# EAGLE design AK-Logger (EAGLE 7.5.0)
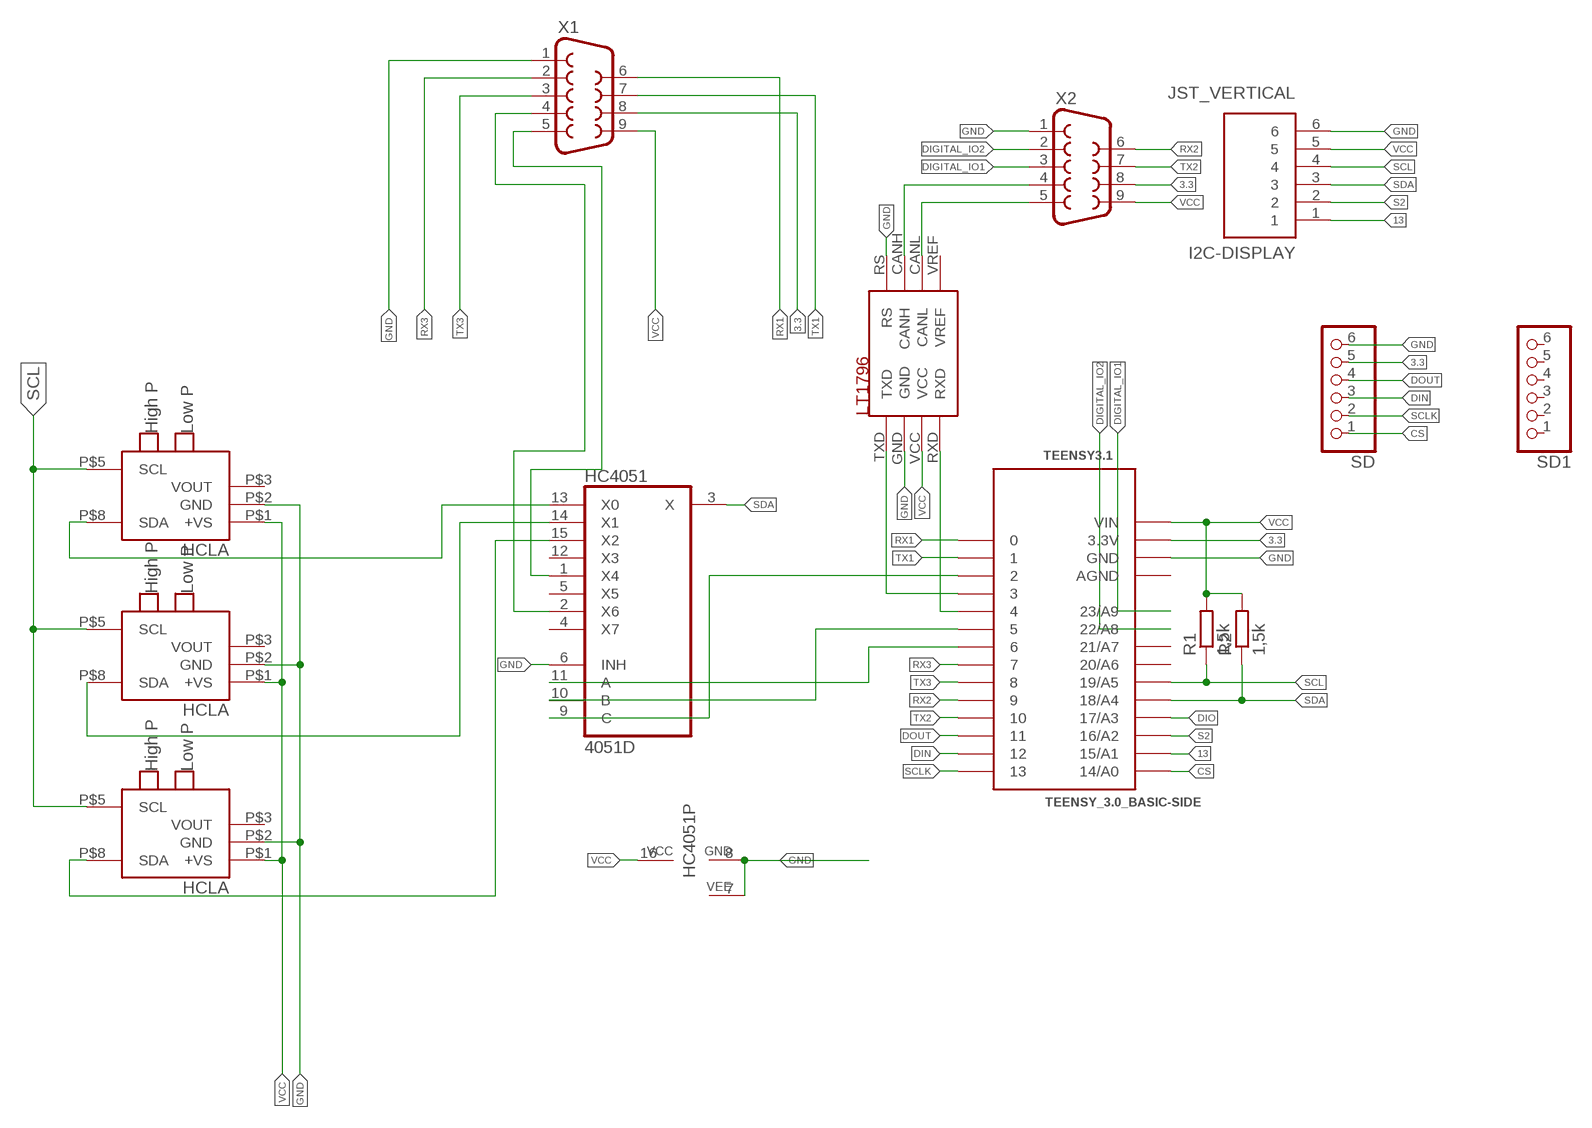
[diagram p0: schematic, sheet 1]

## Parts
HC4051  4051D  [SO16]
HCLA0  HCLA  [HCLA]
HCLA1  HCLA  [HCLA]
HCLA2  HCLA  [HCLA]
I2C-DISPLAY  JST_VERTICAL  [JST-6-SMD-VERT-1.0MM]
R1  1,5k  R-EU_R1206  [R1206]
R2  1,5k  R-EU_R1206  [R1206]
SD  PINHD-1X6  [1X06]
SD1  PINHD-1X6  [1X06]
TEENSY3.1  TEENSY_3.0_BASIC-SIDE  [TEENSY_3.0_BASIC-SIDE]
U$6  LT1796  [SO08]
X1  F09H  [F09H]
X2  F09H  [F09H]

## Nets
3.3: SD.5 TEENSY3.1.3.3V X1.8 X2.8
13: I2C-DISPLAY.1 TEENSY3.1.15/A1
CS: SD.1 TEENSY3.1.14/A0
DIGITAL_IO1: TEENSY3.1.23/A9 X2.3
DIGITAL_IO2: TEENSY3.1.22/A8 X2.2
DIN: SD.3 TEENSY3.1.12
DIO: TEENSY3.1.17/A3
DOUT: SD.4 TEENSY3.1.11
GND: HC4051.6(INH) HC4051.7(VEE) HC4051.8(GND) HCLA0.P$2(GND) HCLA1.P$2(GND) HCLA2.P$2(GND) I2C-DISPLAY.6 SD.6 TEENSY3.1.GND U$6.GND U$6.RS X1.1 X2.1
N$1: HC4051.14(X1) HCLA1.P$8(SDA)
N$2: HC4051.13(X0) HCLA0.P$8(SDA)
N$3: HC4051.15(X2) HCLA2.P$8(SDA)
N$4: HC4051.10(B) TEENSY3.1.5
N$5: TEENSY3.1.3 U$6.TXD
N$6: U$6.CANL X2.5
N$7: TEENSY3.1.4 U$6.RXD
N$8: U$6.CANH X2.4
N$9: HC4051.11(A) TEENSY3.1.6
N$10: HC4051.9(C) TEENSY3.1.2
N$12: HC4051.1(X4) X1.5
N$13: HC4051.2(X6) X1.4
RX1: TEENSY3.1.0 X1.6
RX2: TEENSY3.1.9 X2.6
RX3: TEENSY3.1.7 X1.2
S2: I2C-DISPLAY.2 TEENSY3.1.16/A2
SCL: HCLA0.P$5(SCL) HCLA1.P$5(SCL) HCLA2.P$5(SCL) I2C-DISPLAY.4 R1.1 TEENSY3.1.19/A5
SCLK: SD.2 TEENSY3.1.13
SDA: HC4051.3(X) I2C-DISPLAY.3 R2.1 TEENSY3.1.18/A4
TX1: TEENSY3.1.1 X1.7
TX2: TEENSY3.1.10 X2.7
TX3: TEENSY3.1.8 X1.3
VCC: HC4051.16(VCC) HCLA0.P$1(+VS) HCLA1.P$1(+VS) HCLA2.P$1(+VS) I2C-DISPLAY.5 R1.2 R2.2 TEENSY3.1.VIN U$6.VCC X1.9 X2.9
Unconnected: HC4051.4(X7) HC4051.5(X5) HC4051.12(X3) HCLA0.P$3(VOUT) HCLA1.P$3(VOUT) HCLA2.P$3(VOUT) SD1.1 SD1.2 SD1.3 SD1.4 SD1.5 SD1.6 TEENSY3.1.20/A6 TEENSY3.1.21/A7 U$6.VREF

## Power pins joined to a net without a drawn wire
AGND: TEENSY3.1.AGND

## Library data of the parts
HC4051 = 40xx:4051: 8-channel ANALOG MULTIPLEXER
HCLA0 HCLA1 HCLA2 = HCLA:HCLA
I2C-DISPLAY = SparkFun-Connectors:JST_VERTICAL; PROD_ID: CONN-08249
R1 R2 = rcl:R-EU_: RESISTOR, European symbol
SD SD1 = pinhead:PINHD-1X6: PIN HEADER
TEENSY3.1 = Teensy3.0:TEENSY_3.0_BASIC-SIDE
U$6 = LT1796:LT1796
X1 X2 = con-subd:F09: SUB-D; OC_FARNELL: unknown; OC_NEWARK: unknown

## Board
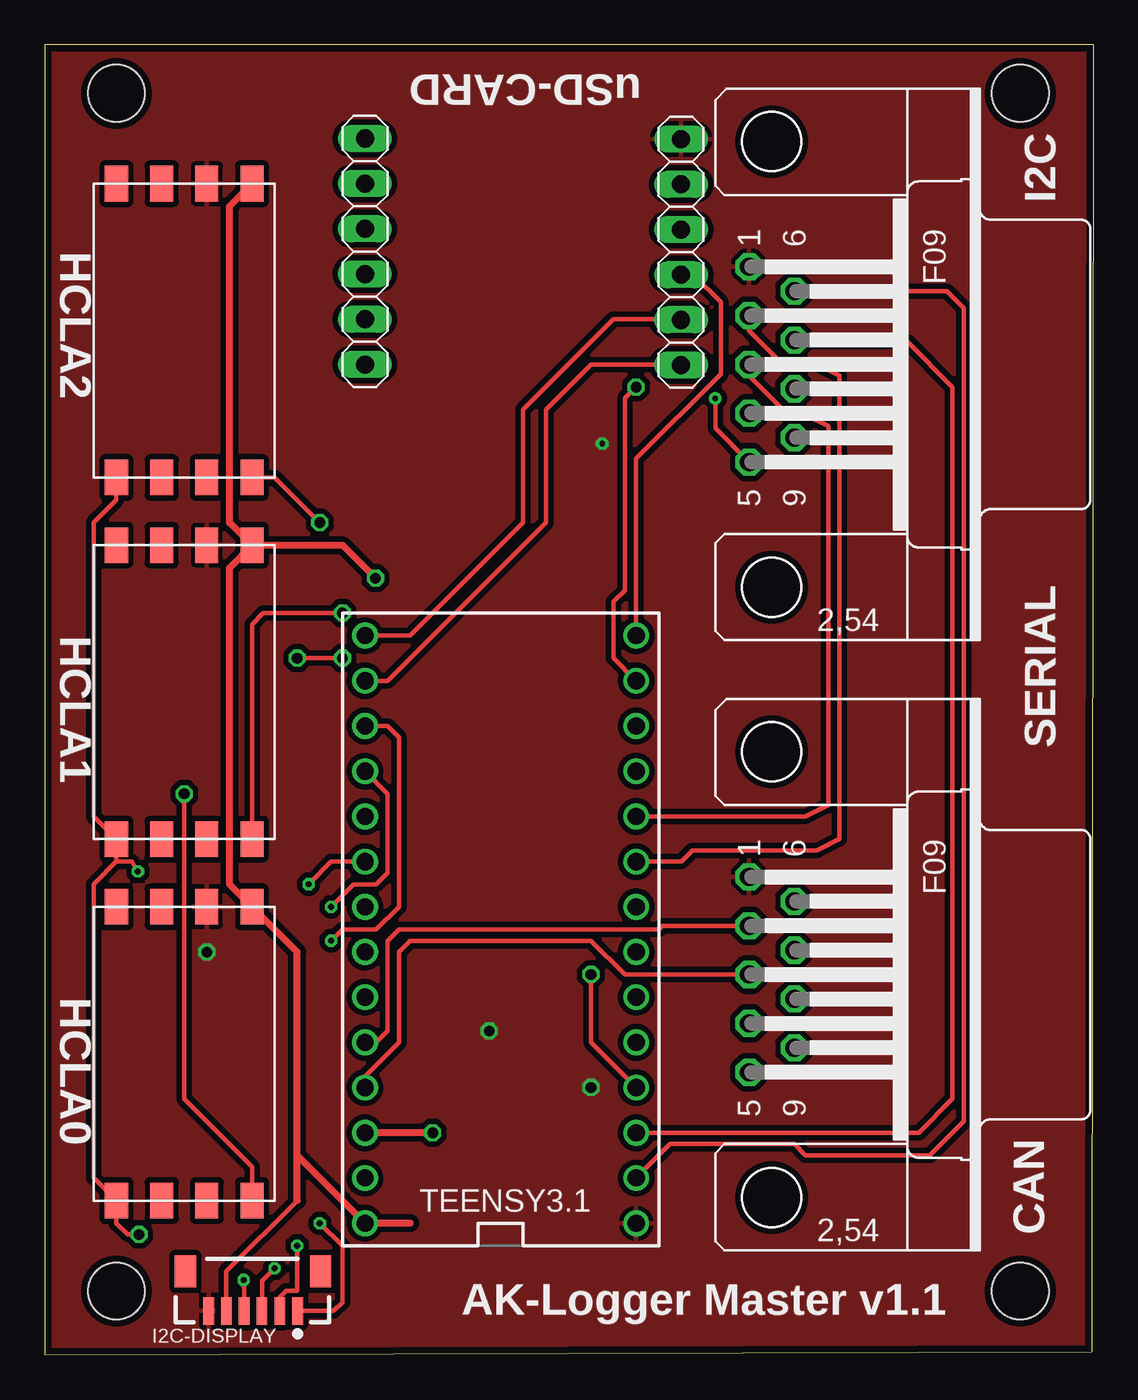
[diagram p1: board, top side]
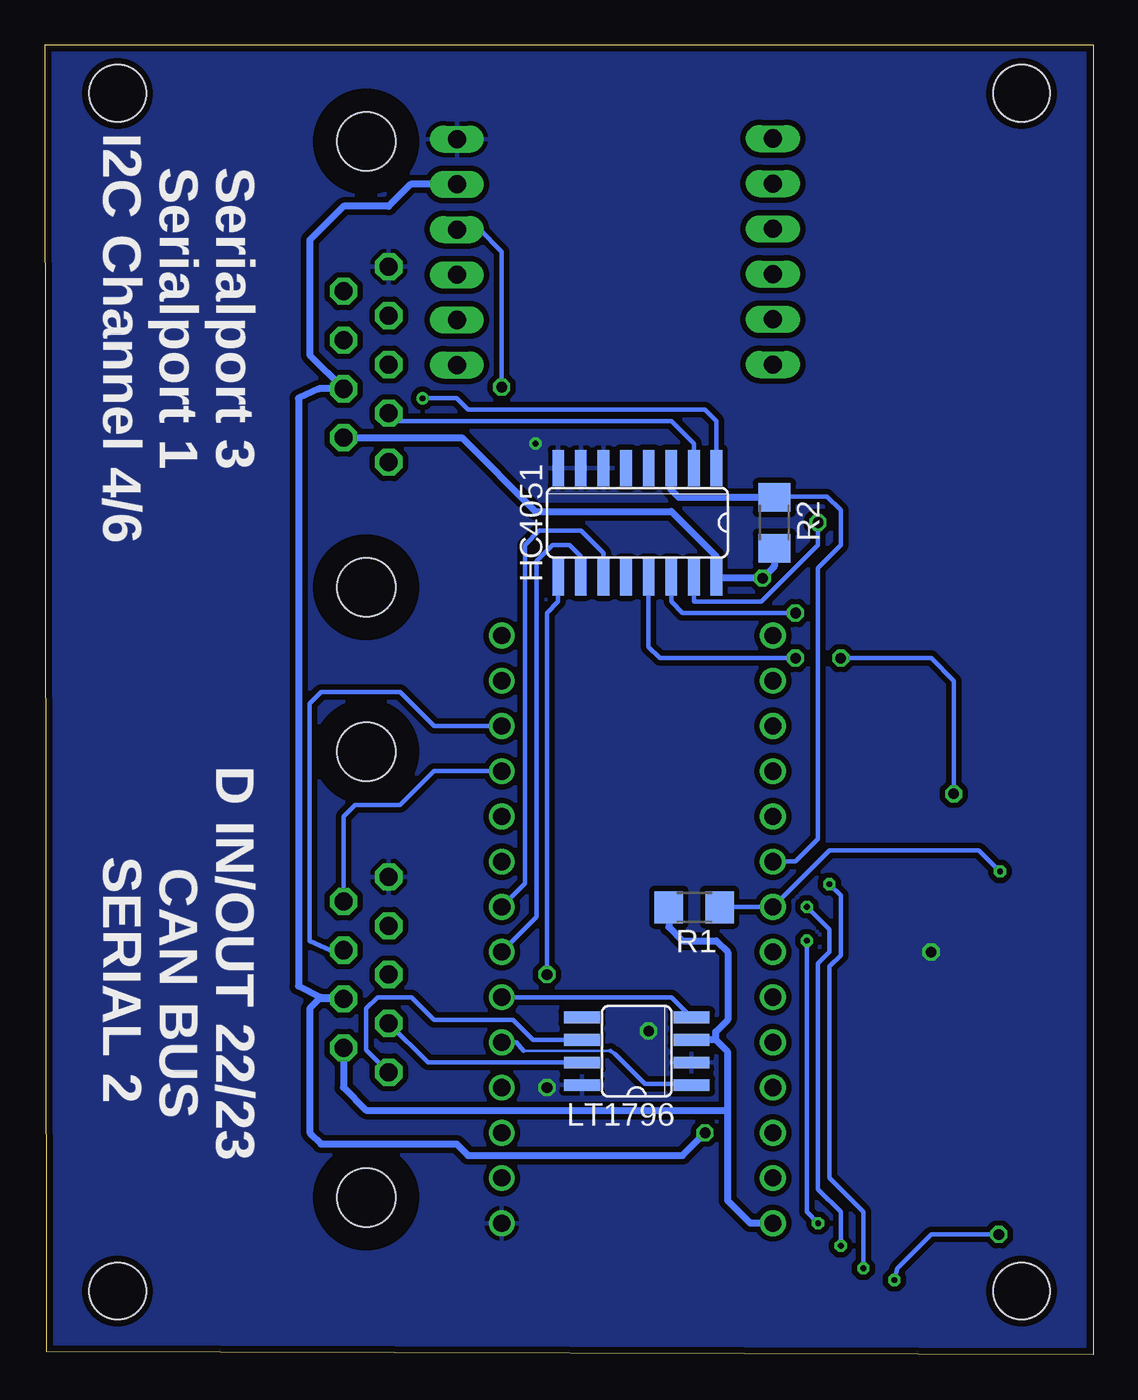
[diagram p2: board, bottom side, seen from below]

Size 58.95 x 73.65 mm. Coordinates in mm from the lower left corner, seen from the top.
Outline: 0,73.65 0,0 58.85,0.17 58.95,73.63 0,73.65
Copper layers (1*16): Top 0.0356mm / dielectric 1.5011mm / Bottom 0.0356mm
Design rules "LaenPCBOrder": minimum track width 6mil, minimum drill 13mil, track to track 6mil, track to pad 6mil, pad to pad 6mil, via to via 6mil, smd to smd 6mil, copper to edge 15mil, drill to drill 6mil, minimum pad ring 7mil, minimum via ring 7mil, stop-mask expansion 3mil, vias tented up to drill 0mil, thermal gap 10mil
Holes 3.2 mm at 4.04,70.91 54.84,70.91 4.04,3.6 54.84,3.6

### Footprints (pad centres in the part's own frame; a part is rotated, then mirrored left to right if it is on the bottom)
SO16 = smd 0.66 x 2.032: 1 -4.445,-3.073; 2 -3.175,-3.073; 3 -1.905,-3.073; 4 -0.635,-3.073; 5 0.635,-3.073; 6 1.905,-3.073; 7 3.175,-3.073; 8 4.445,-3.073; 9 4.445,3.073; 10 3.175,3.073; 11 1.905,3.073; 12 0.635,3.073; 13 -0.635,3.073; 14 -1.905,3.073; 15 -3.175,3.073; 16 -4.445,3.073
HCLA = smd 1.3 x 2: P$1 -3.81,-7.62; P$2 -1.27,-7.62; P$3 1.27,-7.62; P$4 3.81,-7.62; P$5 3.81,8.89; P$6 1.27,8.89; P$7 -1.27,8.89; P$8 -3.81,8.89
JST-6-SMD-VERT-1.0MM = smd 0.6 x 1.55: 1 -2.54,1.27; 2 -1.54,1.27; 3 -0.54,1.27; 4 0.46,1.27; 5 1.46,1.27; 6 2.46,1.27 | smd 1.2 x 1.8: P$1 -3.84,-0.955; P$2 3.76,-0.955
R1206 = smd 1.6 x 1.803: 1 -1.422,0; 2 1.422,0
1X06 = drill 1.016 long: 1 -6.35,0; 2 -3.81,0; 3 -1.27,0; 4 1.27,0; 5 3.81,0; 6 6.35,0
TEENSY_3.0_BASIC-SIDE = drill 0.965: 0 -7.62,13.97; 1 -7.62,11.43; 2 -7.62,8.89; 3 -7.62,6.35; 3.3V 7.62,11.43; 4 -7.62,3.81; 5 -7.62,1.27; 6 -7.62,-1.27; 7 -7.62,-3.81; 8 -7.62,-6.35; 9 -7.62,-8.89; 10 -7.62,-11.43; 11 -7.62,-13.97; 12 -7.62,-16.51; 13 7.62,-16.51; 14/A0 7.62,-13.97; 15/A1 7.62,-11.43; 16/A2 7.62,-8.89; 17/A3 7.62,-6.35; 18/A4 7.62,-3.81; 19/A5 7.62,-1.27; 20/A6 7.62,1.27; 21/A7 7.62,3.81; 22/A8 7.62,6.35; 23/A9 7.62,8.89; AGND 7.62,13.97; GND -7.62,16.51; VIN 7.62,16.51
SO08 = smd 0.66 x 2.032: CANH -0.635,3.073; CANL 0.635,3.073; GND -0.635,-3.073; RS -1.905,3.073; RXD 1.905,-3.073; TXD -1.905,-3.073; VCC 0.635,-3.073; VREF 1.905,3.073
F09H = drill 1.016 octagon: 1 -5.486,-1.27; 2 -2.743,-1.27; 3 0,-1.27; 4 2.743,-1.27; 5 5.486,-1.27; 6 -4.115,1.27; 7 -1.372,1.27; 8 1.372,1.27; 9 4.115,1.27 | hole 3.302: -12.522,0; 12.522,0

### Placement (x,y rotation side)
HC4051  25.63,46.78 180 bottom
HCLA0  7.85,17.57 180 top
HCLA1  7.85,37.89 180 top
HCLA2  7.85,58.21 180 top
I2C-DISPLAY  11.68,3.75 180 top
R1  22.44,25.16 180 bottom
R2  17.93,46.77 270 bottom
SD  35.78,61.98 90 top
SD1  18.01,62.02 90 top
TEENSY3.1  25.63,23.92 180 top
U$6  25.67,17.07 90 bottom
X1  40.87,55.67 270 top
X2  40.87,21.38 270 top

### Tracks (layer width: path | path; a pad name or v marks a point on that pad's centre or on a via)
3.3  (via drill 0.6)
  Top 0.406: v21.82,12.49 TEENSY3.1.3.3V
  Bottom 0.406: v21.82,12.49 23.09,11.22 35.16,11.22 35.79,11.85 43.41,11.85 44.05,12.49 44.05,19.47 43.52,20.01 X2.8 42.25,20.11 43.41,20.11 44.68,20.74 44.68,53.76 43.52,54.3 X1.8 44.05,56.2 44.05,62.65 42.14,64.56 39.6,64.56 38.37,65.79 SD.5
13  (via drill 0.33)
  Top 0.254: v16.11,23.28 16.74,23.92 18.65,23.92 19.92,25.19 19.92,34.71 19.28,35.35 TEENSY3.1.15/A1 | I2C-DISPLAY.1 16.26,2.48 16.74,2.96 16.74,6.14 v15.47,7.41
  Bottom 0.254: v15.47,7.41 16.11,8.04 v16.11,23.28
CS
  Top 0.254: TEENSY3.1.14/A0 19.28,37.89 28.17,46.78 28.17,53.13 30.71,55.67 35.74,55.67 SD.1
DIGITAL_IO1
  Top 0.254: TEENSY3.1.23/A9 18.01,15.66 19.92,17.57 19.92,22.65 20.55,23.28 30.71,23.28 32.62,21.38 X2.3
DIGITAL_IO2
  Top 0.254: X2.2 34.73,24.12 34.52,23.92 19.92,23.92 19.28,23.28 19.28,18.2 18.65,17.57 TEENSY3.1.22/A8
DIN
  Top 0.254: TEENSY3.1.12 33.25,50.38 38.01,55.14 38.01,59.16 36.43,60.75 35.81,60.75 SD.3
DOUT  (via drill 0.6)
  Top 0.254: TEENSY3.1.11 31.98,39.16 31.98,42.33 32.62,42.97 32.62,53.76 v33.25,54.4
  Bottom 0.254: v33.25,54.4 33.25,62.02 34.52,63.29 35.74,63.29 SD.4
GND  (via drill 0.33, 0.6)
  other vias: 25,18.2 30.71,15.03 31.35,51.22 9.12,22.65
  pour Bottom (isolate 0.305): 58.65,0.42 0.23,0.42 0.23,73.45 58.65,73.45
  pour Top (isolate 0.305): 0.23,0.42 58.65,0.42 58.65,73.45 0.23,73.45
N$1  (via drill 0.6)
  Top 0.254: HCLA1.P$8 11.66,41.06 12.3,41.7 v16.74,41.7
  Bottom 0.254: HC4051.14 23.73,42.33 23.09,41.7 v16.74,41.7
N$2  (via drill 0.6)
  Top 0.254: v16.74,39.16 v14.2,39.16 | v7.85,31.54 7.85,14.39 11.66,10.58 HCLA0.P$8
  Bottom 0.254: HC4051.13 25,39.79 24.36,39.16 v16.74,39.16 | v14.2,39.16 9.12,39.16 7.85,37.89 v7.85,31.54
N$3  (via drill 0.6)
  Top 0.254: v15.47,46.78 12.93,49.32 HCLA2.P$8
  Bottom 0.254: HC4051.15 22.46,42.33 18.65,42.33 15.47,45.51 v15.47,46.78
N$4
  Bottom 0.254: HC4051.10 28.81,44.87 29.44,45.51 30.4,45.51 31.29,44.62 31.29,24.62 TEENSY3.1.5
N$5
  Bottom 0.152: 32.03,17.09 27.16,17.09
  Bottom 0.254: TEENSY3.1.3 32.41,17.57 32.03,17.09 | 27.16,17.09 26.9,16.93 26.89,16.93 25.19,15.23 22.66,15.23 U$6.TXD
N$6
  Bottom 0.254: U$6.CANL 31.49,17.71 32.62,18.84 37.06,18.84 38.33,20.11 40.24,20.11 40.87,19.47 40.87,17.16 X2.5
N$7
  Bottom 0.254: TEENSY3.1.4 23.73,20.11 U$6.RXD
N$8
  Bottom 0.254: U$6.CANH 37.41,16.44 X2.4
N$9
  Bottom 0.254: HC4051.11 27.54,45.07 28.79,46.32 31.15,46.32 31.94,45.53 31.94,26.5 TEENSY3.1.6
N$10  (via drill 0.6)
  Top 0.254: v30.71,21.38 30.71,17.57 TEENSY3.1.2
  Bottom 0.254: HC4051.9 30.08,42.33 30.71,41.7 v30.71,21.38
N$12  (via drill 0.33 pad 0.25)
  Top 0.254: v37.7,53.76 37.7,52.09 X1.5
  Bottom 0.254: HC4051.1 21.19,52.49 21.82,53.13 35.16,53.13 35.79,53.76 v37.7,53.76
N$13
  Bottom 0.254: HC4051.2 22.46,51.22 23.73,52.49 39.17,52.49 X1.4
RX1
  Top 0.254: X1.6 50.73,59.78 51.67,58.84 51.67,13.12 49.76,11.22 42.78,11.22 42.14,11.85 35.16,11.85 TEENSY3.1.0
RX2
  Bottom 0.254: X2.6 42.14,30.27 41.51,30.9 38.97,30.9 37.06,32.81 TEENSY3.1.9
RX3
  Top 0.254: X1.2 39.6,57.57 41.51,55.67 43.41,55.67 44.68,55.03 44.68,29 43.41,28.36 36.43,28.36 35.79,27.73 TEENSY3.1.7
S2  (via drill 0.33)
  Top 0.254: v16.11,25.19 17.38,26.46 18.65,26.46 19.28,27.09 19.28,31.54 TEENSY3.1.16/A2 | I2C-DISPLAY.2 13.22,3.25 13.57,3.6 14.2,3.6 v14.2,6.14
  Bottom 0.254: v16.11,25.19 14.84,23.92 14.84,22.65 15.47,22.01 15.47,9.31 14.2,8.04 v14.2,6.14
SCL  (via drill 0.33, 0.6)
  Top 0.254: HCLA2.P$5 4.04,48.05 2.77,46.78 2.77,30.27 HCLA1.P$5 4.04,27.73 | 4.04,27.73 2.77,26.46 2.77,9.95 HCLA0.P$5 4.04,7.41 4.68,6.77 v5.31,6.77 | 4.04,27.73 4.91,27.73 v5.25,27.18 | I2C-DISPLAY.4 11.22,4.04 v11.19,4.21
  Bottom 0.254: 20.72,25.19 R1.1 20.99,25.19 TEENSY3.1.19/A5 14.84,28.36 6.44,28.36 v5.25,27.18 | v11.19,4.21 11.03,4.87 9.12,6.77 v5.31,6.77
SCLK
  Top 0.254: TEENSY3.1.13 20.55,40.43 26.9,46.78 26.9,53.13 31.98,58.21 35.74,58.21 SD.2
SDA  (via drill 0.33)
  Top 0.254: I2C-DISPLAY.3 12.22,4.16 v12.93,4.87 | v14.84,26.46 16.11,27.73 TEENSY3.1.18/A4
  Bottom 0.254: TEENSY3.1.18/A4 16.74,27.73 15.47,29 15.47,44.24 14.2,45.51 14.2,47.48 14.98,48.26 17.87,48.26 R2.1 | v12.93,4.87 12.93,8.04 14.84,9.95 14.83,21.83 14.2,22.46 14.2,25.82 v14.84,26.46
  Bottom 0.406: HC4051.3 23.77,49.81 23.77,48.66 23.3,48.19 R2.1
TX1
  Top 0.254: TEENSY3.1.1 49.13,12.49 51.03,14.39 51.03,54.4 48.49,56.94 42.25,56.94 X1.7
TX2
  Bottom 0.254: X2.7 42.88,22.75 44.05,23.28 44.05,36.62 43.41,37.25 38.97,37.25 37.06,35.35 TEENSY3.1.10
TX3
  Top 0.254: TEENSY3.1.8 42.78,30.27 44.05,30.9 44.05,52.2 42.79,52.82 41.81,52.82 39.6,55.03 X1.3
VCC  (via drill 0.6)
  Top 0.254: I2C-DISPLAY.5 10.22,4.7 14.2,8.68
  Top 0.406: 14.2,8.68 14.2,11.22 | 14.2,11.22 14.2,22.65 HCLA0.P$1 10.39,26.46 10.39,44.24 HCLA1.P$1 | HCLA1.P$1 10.39,46.78 10.39,64.56 HCLA2.P$1 | HCLA1.P$1 16.75,45.51 v18.6,43.66 | 20.55,7.41 TEENSY3.1.VIN 14.2,11.22
  Bottom 0.406: TEENSY3.1.VIN 19.28,7.41 20.55,8.68 20.55,13.76 | 20.55,13.76 20.55,17.03 21.23,17.71 | 21.23,17.71 U$6.VCC | 21.23,17.71 21.23,18.17 20.55,18.84 20.55,22.65 21.19,23.28 23.09,23.28 23.86,24.05 R1.2 | R2.2 17.93,44.32 18.01,44.24 18.02,44.24 v18.6,43.66 21.14,43.66 HC4051.16 21.19,44.87 23.73,47.41 31.35,47.41 35.49,51.55 X1.9 | X2.9 42.14,15.03 40.87,13.76 20.55,13.76

### Text on the board
tNames: uSD-CARD | I2C | SERIAL | CAN | AK-Logger Master v1.1
bNames: I2C Channel 4/6 | Serialport 3 | Serialport 1 | D IN/OUT 22/23 | SERIAL 2 | CAN BUS